# Altium schematic sheet esquema.SchDoc
size 287 x 152 mm
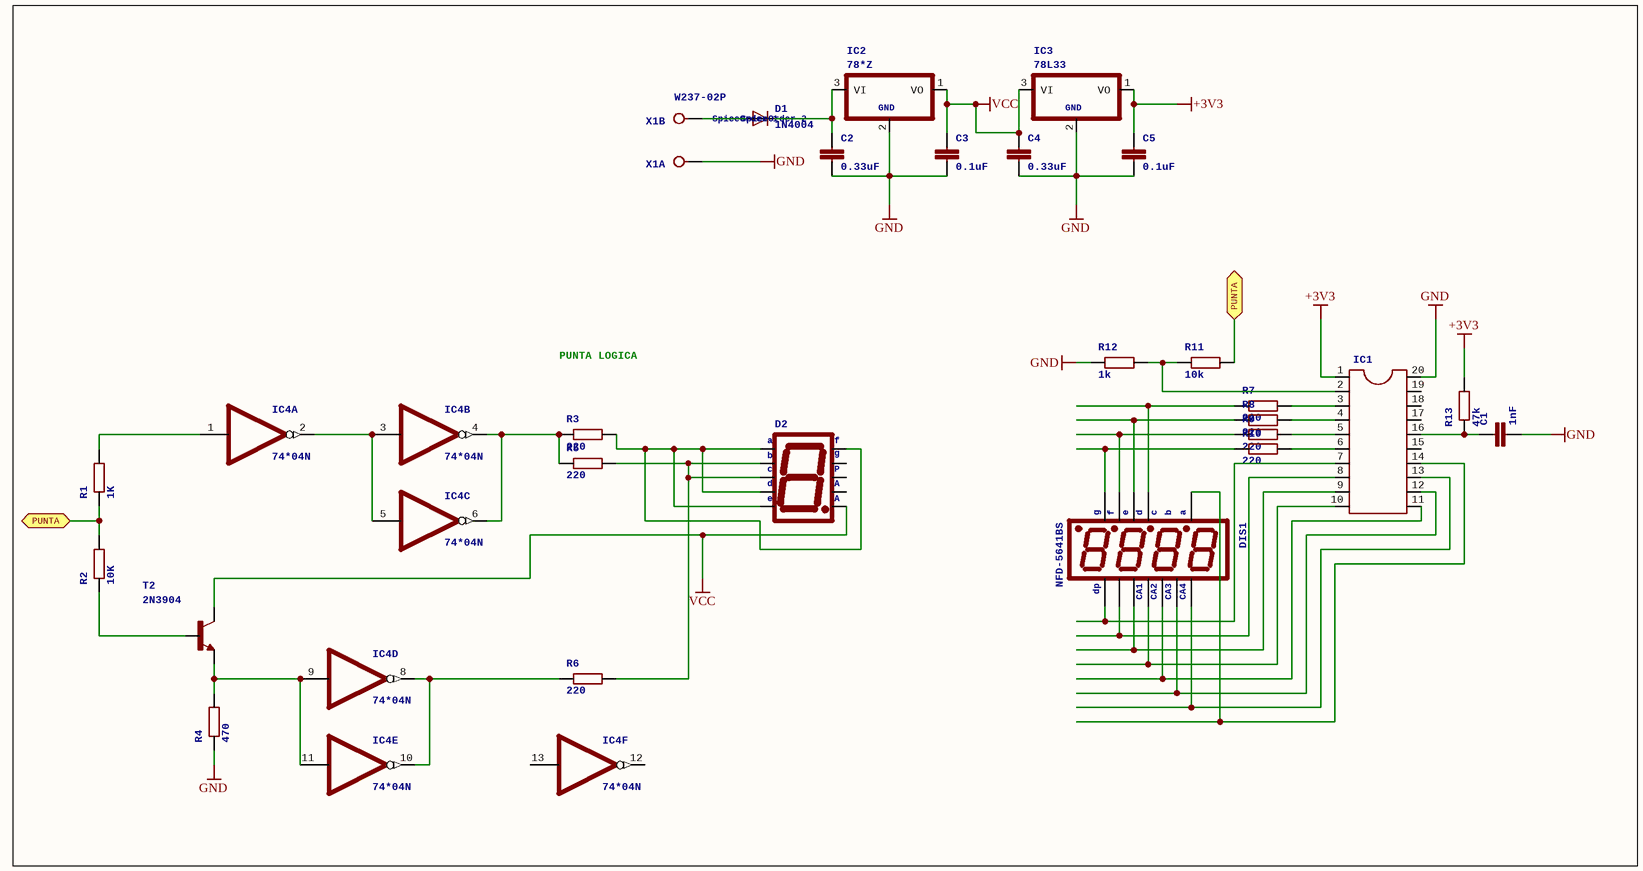
[diagram p0: esquema.SchDoc]

## Parts
C1  1nF  [C050-024X044]
C2  0.33uF  [C050-024X044]
C3  0.1uF  [C050-024X044]
C4  0.33uF  [C050-024X044]
C5  0.1uF  [C050-024X044]
D1  1N4004  SpiceOrder1: SpiceOrder 1  SpiceOrder2: SpiceOrder 2  [DO41-10]
D2  7SEG-CA  [7SEG-13]  (value not drawn)
DIS1  NFD-5641BS  [NFD-5641]
IC1  DIL20S  [SOCKET-20]  (value not drawn)
IC2  78*Z  [TO92]
IC3  78L33  [TO92]
IC4  74*04N  [DIL14]  (parts A,B,C,D,E,F of 7)
R1  1K  [0207/7]
R2  10K  [0207/7]
R3  220  [0207/7]
R4  470  [0207/7]
R5  220  [0207/7]
R6  220  [0207/7]
R7  220  [0207/7]
R8  220  [0207/7]
R9  220  [0207/7]
R10  220  [0207/7]
R11  10k  [0207/7]
R12  1k  [0207/7]
R13  47k  [0207/7]
T2  2N3904  [TO92]
X1  W237-02P  [W237-132]  (value not drawn)  (parts A,B of 2)

## Ports
PUNTA

## Nets
+3V3: C5.1 IC1.1 IC3.1(VO) R13.2
GND: C1.2 C2.2 C3.2 C4.2 C5.2 IC1.20 IC2.2(GND) IC3.2(GND) R4.1 R12.1 X1.1(KL)
VCC: C3.1 C4.1 D2.8(CA2) IC2.1(VO) IC3.3(VI) T2.1(C)
PUNTA: R1.1 R2.2 R11.2 ; port PUNTA
NetC1_1: C1.1 IC1.16 R13.1
NetC2_1: C2.1 D1.C IC2.3(VI)
NetD1_A: D1.A X1.2(KL)
NetD2_1: D2.1(E) D2.2(D) D2.7(A) D2.9(F) R3.2
NetD2_4: D2.4(C) D2.6(B) R5.2 R6.2
NetDIS1_P$1: DIS1.P$1 IC1.11
NetDIS1_P$2: DIS1.P$2 IC1.10
NetDIS1_P$3: DIS1.P$3 IC1.14
NetDIS1_P$4: DIS1.P$4 IC1.9
NetDIS1_P$5: DIS1.P$5 IC1.13
NetDIS1_P$6: DIS1.P$6 R10.1
NetDIS1_P$7: DIS1.P$7 IC1.8
NetDIS1_P$8: DIS1.P$8 R9.1
NetDIS1_P$9: DIS1.P$9 R8.1
NetDIS1_P$10: DIS1.P$10 IC1.12
NetDIS1_P$11: DIS1.P$11 IC1.7
NetDIS1_P$12: DIS1.P$12 R7.1
NetIC1_2: IC1.2 R11.1 R12.2
NetIC1_3: IC1.3 R7.2
NetIC1_4: IC1.4 R8.2
NetIC1_5: IC1.5 R9.2
NetIC1_6: IC1.6 R10.2
NetIC4_1: IC4.1(I) R1.2
NetIC4_2: IC4.2(O) IC4.3(I) IC4.5(I)
NetIC4_4: IC4.4(O) IC4.6(O) R3.1 R5.1
NetIC4_8: IC4.8(O) IC4.10(O) R6.1
NetIC4_9: IC4.9(I) IC4.11(I) R4.2 T2.3(E)
NetR2_1: R2.1 T2.2(B)

Not connected (* = marked no-connect by the designer): D2 3(CA1) 5(DP) 10(G); IC1 15 17 18 19; IC4 12(O) 13(I)

## Notes on the sheet
- PUNTA LOGICA

## Library data of the parts
C1-C5 = C-EU050-024X044: CAPACITOR, European symbol
D1 = 1N4004: DIODE   general purpose rectifier, 1 A
D2 = 7SEG-CA: 7-segment DISPLAY   single anode, 13 mm; a: a; b: b; c: c; d: d; e: e; f: f; g: g; P: P; A: A
DIS1 = NFD-5641BS: Four Digit 0.56" CA Seven-Segment LED Display Futurlec part number: 7FR5641BS Created by RobG; CA3: CA3; CA4: CA4; dp: dp; a: a; b: b; c: c; d: d; e: e; f: f; g: g; CA1: CA1; CA2: CA2
IC1 = DIL20S: Dual In Line / Socket
IC2 IC3 = 78*Z: Positive VOLTAGE REGULATOR   Source: http://cache.national.com/ds/LM/LM78L05.pdf http://www.fairchildsemi.com/ds/LM/LM7805.pdf; GND: GND
IC4 = 74*04N: Hex INVERTER
R1-R13 = R-EU_0207/7: RESISTOR, European symbol
T2 = 2N3904: NPN TRANSISTOR
X1 = W237-02P: WAGO SREW CLAMP; MF: *; MPN: *; OC_FARNELL: unknown; OC_NEWARK: unknown